# Altium schematic sheet power.SchDoc
size A
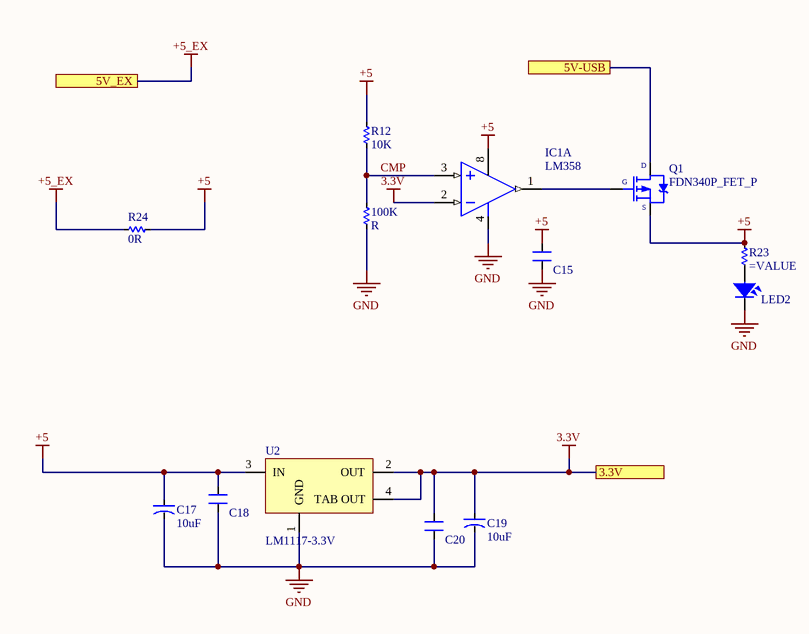
[diagram p0: power.SchDoc]

## Parts
100K  R  [RES-SMD-0603_BIG]
C15  CN  [CN-SMD-0603_big]  (value not drawn)
C17  10uF  [CAP-ALU-SMD-6.3x7.7x2.2]
C18  CN  [CN-SMD-0603_big]  (value not drawn)
C19  10uF  [CAP-ALU-SMD-6.3x7.7x2.2]
C20  CN  [CN-SMD-0603_big]  (value not drawn)
IC1  LM358  [SO8]  (part A of 2)
LED2  LED  [LED-RED-0805]  (value not drawn)
Q1  FDN340P_FET_P  [SOT23F]
R12  10K  [RES-SMD-0603_BIG]
R23  (no value)  [RES-SMD-0603_BIG]
R24  0R  [RES-SMD-0603_BIG]
U2  LM1117-3.3V  [SOT223]

## Ports
3.3V, 5V-USB, 5V_EX

## Nets
3.3V: C19.1 C20.2 IC1.2(IN-) U2.2(OUT) U2.4(TAB_OUT) ; port 3.3V
+5: C15.2 C17.1 C18.2 IC1.8(+V) Q1.2(S) R12.1 R23.1 R24.2 U2.3(IN)
+5_EX: R24.1 ; port 5V_EX
GND: 100K.2 C15.1 C17.2 C18.1 C19.2 C20.1 IC1.4(-V) LED2.2 U2.1(GND)
5V-USB: Q1.3(D) ; port 5V-USB
CMP: 100K.1 IC1.3(IN+) R12.2
NetIC1_1: IC1.1(OUT) Q1.1(G)
NetLED2_1: LED2.1 R23.2

## Library data of the parts
C15 C18 C20 = CN: Value: 33pF
C17 C19 = CN-ALU-SMD: Polarized Capacitor (Axial); Published: 8-Jun-2000; LatestRevisionDate: 17-Jul-2002; LatestRevisionNote: Re-released for DXP Platform.; PackageReference: POLAR0.8; Publisher: Altium Limited
IC1 = LM358: Low-Power Dual Operational Amplifier; Value: LM358
LED2 = LED SMD: Value: LED 3 - 5 ly 2 Colour
Q1 = FDN340P_FET_P: P-Channel, 20V, 2A; Value: IRF840
R12 R23 R24 = R
  R23: Parameter 1: *
U2 = LM1117: 800mA Low-Dropout Linear Regulator; Creator: Nguyen Ba Bien; Website: http://group3i.net